# EAGLE design Placa Opto (EAGLE 9.0.1)
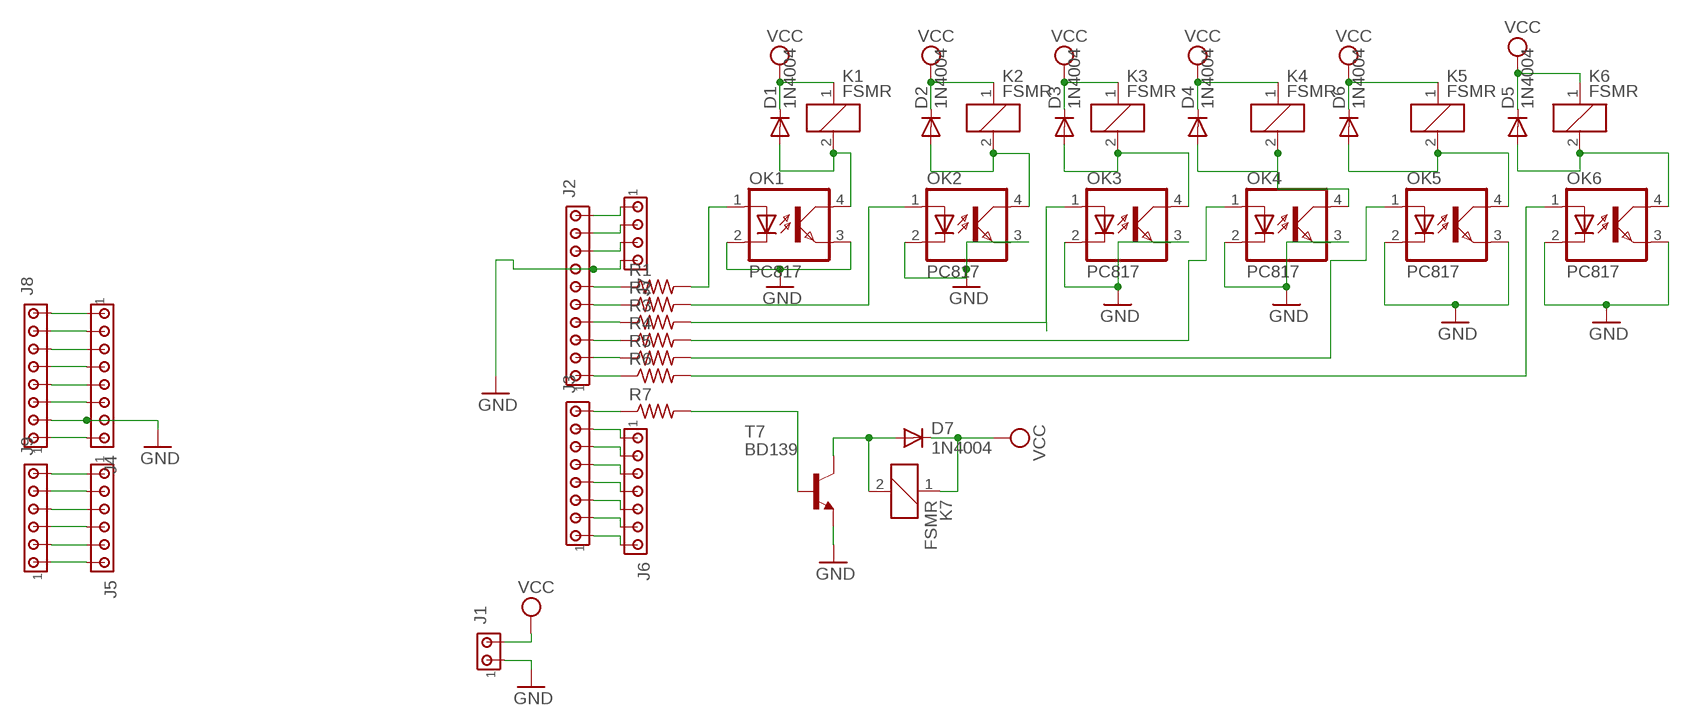
[diagram p0: schematic, sheet 1]

## Parts
D1  1N4004  [DO41-10]
D2  1N4004  [DO41-10]
D3  1N4004  [DO41-10]
D4  1N4004  [DO41-10]
D5  1N4004  [DO41-10]
D6  1N4004  [DO41-10]
D7  1N4004  [DO41-10]
J1  MTA02-156  [1X2MTA]
J2  MTA10-100  [10X10MTA]
J3  MTA08-100  [10X08MTA]
J4  MTA08-100  [10X08MTA]
J5  MTA06-100  [10X06MTA]
J6  MTA07-100  [10X07MTA]
J7  MTA04-100  [10X04MTA]
J8  MTA08-100  [10X08MTA]
J9  MTA06-100  [10X06MTA]
K1  FSMR  [FSMR]
K2  FSMR  [FSMR]
K3  FSMR  [FSMR]
K4  FSMR  [FSMR]
K5  FSMR  [FSMR]
K6  FSMR  [FSMR]
K7  FSMR  [FSMR]
OK1  PC817  [DIL04]
OK2  PC817  [DIL04]
OK3  PC817  [DIL04]
OK4  PC817  [DIL04]
OK5  PC817  [DIL04]
OK6  PC817  [DIL04]
R1  R-US_0207/10  [0207/10]
R2  R-US_0207/10  [0207/10]
R3  R-US_0207/10  [0207/10]
R4  R-US_0207/10  [0207/10]
R5  R-US_0207/10  [0207/10]
R6  R-US_0207/10  [0207/10]
R7  R-US_0207/10  [0207/10]
T7  BD139  [TO126]

## Nets
GND: J1.1 J2.7 J4.7 J7.4 J8.2 OK1.2(C) OK1.3(EMIT) OK2.2(C) OK2.3(EMIT) OK3.2(C) OK3.3(EMIT) OK4.2(C) OK4.3(EMIT) OK5.2(C) OK5.3(EMIT) OK6.2(C) OK6.3(EMIT) T7.1(E)
N$1: J2.1 R6.1
N$2: J2.2 R5.1
N$3: J2.3 R4.1
N$4: J2.4 R3.1
N$5: J2.5 R2.1
N$6: J2.6 R1.1
N$7: OK1.1(A) R1.2
N$8: D1.A K1.2 OK1.4(COL)
N$9: OK2.1(A) R2.2
N$10: D2.A K2.2 OK2.4(COL)
N$11: OK3.1(A) R3.2
N$12: D3.A K3.2 OK3.4(COL)
N$13: OK4.1(A) R4.2
N$14: D4.A K4.2 OK4.4(COL)
N$15: OK5.1(A) R5.2
N$16: OK6.1(A) R6.2
N$18: D5.A K6.2 OK6.4(COL)
N$19: J3.8 R7.1
N$20: R7.2 T7.3(B)
N$21: D7.A K7.2 T7.2(C)
N$22: D6.A K5.2 OK5.4(COL)
N$23: J3.7 J6.1
N$24: J3.6 J6.2
N$25: J3.5 J6.3
N$26: J3.4 J6.4
N$27: J3.3 J6.5
N$28: J3.2 J6.6
N$29: J3.1 J6.7
N$31: J2.8 J7.3
N$32: J2.9 J7.2
N$33: J2.10 J7.1
N$34: J4.1 J8.8
N$35: J4.2 J8.7
N$36: J4.3 J8.6
N$37: J4.4 J8.5
N$38: J4.5 J8.4
N$39: J4.6 J8.3
N$41: J4.8 J8.1
N$42: J5.1 J9.6
N$43: J5.2 J9.5
N$44: J5.3 J9.4
N$45: J5.4 J9.3
N$46: J5.5 J9.2
N$47: J5.6 J9.1
VCC: D1.C D2.C D3.C D4.C D5.C D6.C D7.C J1.2 K1.1 K2.1 K3.1 K4.1 K5.1 K6.1 K7.1
Unconnected: K1.O(2:O) K1.P(2:P) K1.P@(2:P) K1.S(2:S) K2.O(2:O) K2.P(2:P) K2.P@(2:P) K2.S(2:S) K3.O(2:O) K3.P(2:P) K3.P@(2:P) K3.S(2:S) K4.O(2:O) K4.P(2:P) K4.P@(2:P) K4.S(2:S) K5.O(2:O) K5.P(2:P) K5.P@(2:P) K5.S(2:S) K6.O(2:O) K6.P(2:P) K6.P@(2:P) K6.S(2:S) K7.O(2:O) K7.P(2:P) K7.P@(2:P) K7.S(2:S)

## Library data of the parts
D1-D7 = diode:1N4004: DIODE general purpose rectifier, 1 A
J1 = con-amp:MTA02-156: AMP connector
J2 = con-amp:MTA10-100: AMP connector
J3 J4 J8 = con-amp:MTA08-100: AMP connector
J5 J9 = con-amp:MTA06-100: AMP connector Connection corrected 2014-09-19
J6 = con-amp:MTA07-100: AMP connector
J7 = con-amp:MTA04-100: AMP connector
K1-K7 = relay:FSMR: RELAY 1 x switch, same as FBR21D/H, Fujitsu; OC_FARNELL: unknown; OC_NEWARK: unknown
OK1-OK6 = optocoupler:PC817: SHARP OPTO COUPLER; MPN: PC817X4J000F; OC_FARNELL: 9707727; OC_NEWARK: 97K7059
R1-R7 = rcl:R-US_: RESISTOR, American symbol; SPICEPREFIX: R
T7 = transistor-neu-to92:BD139: NPN TRANSISTOR

## Board
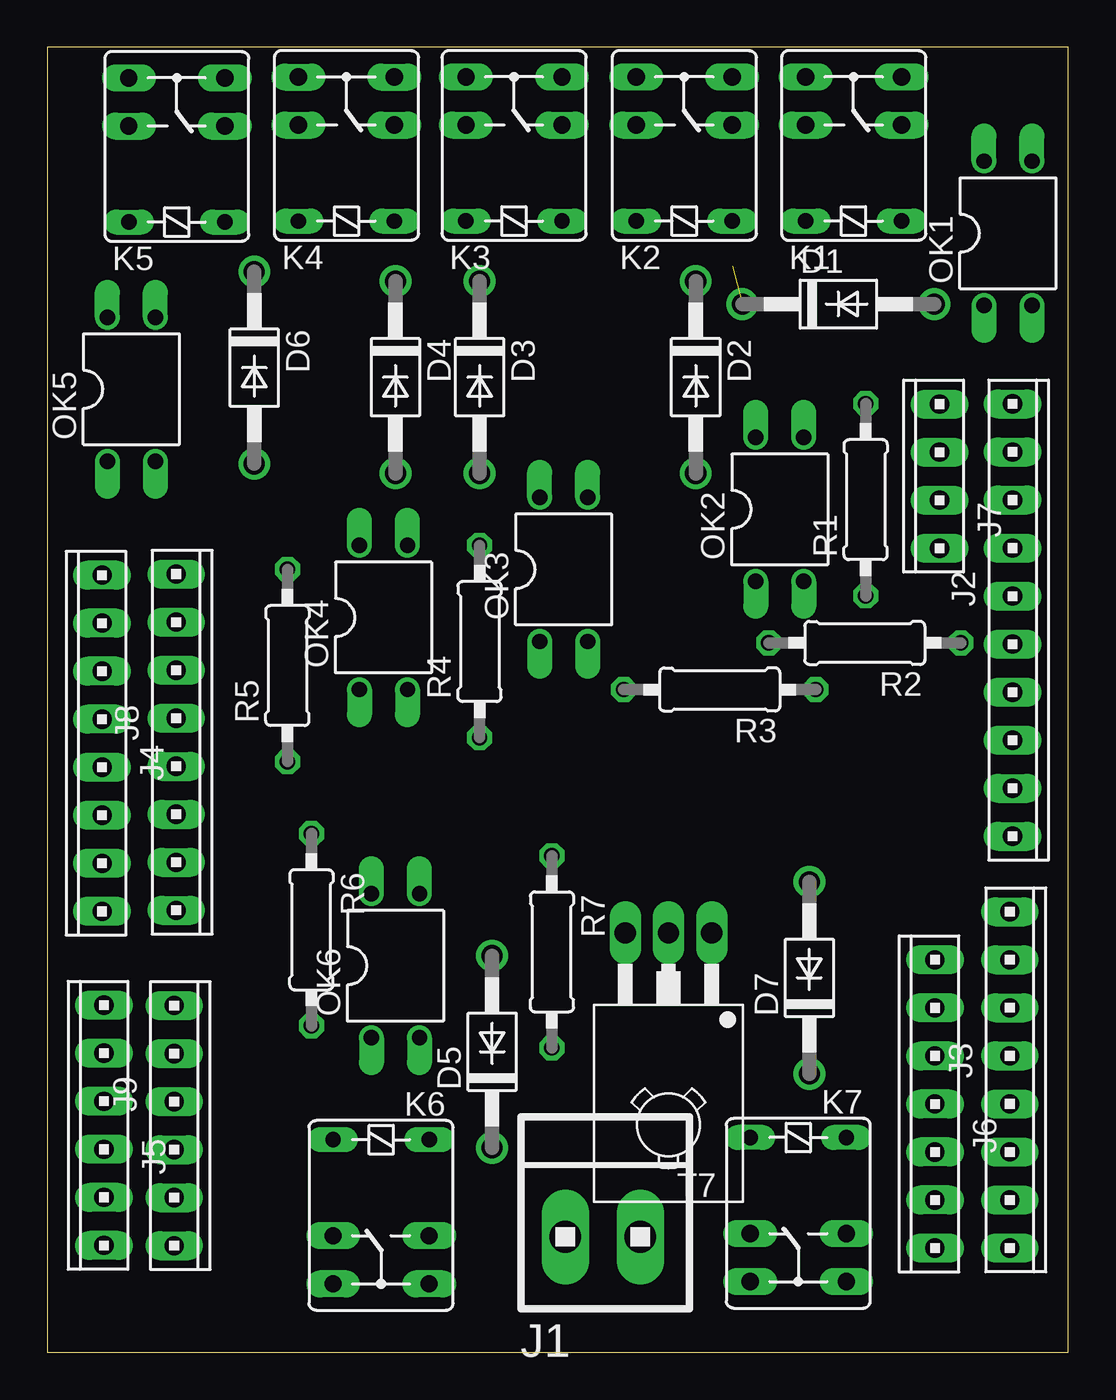
[diagram p1: board, top side]
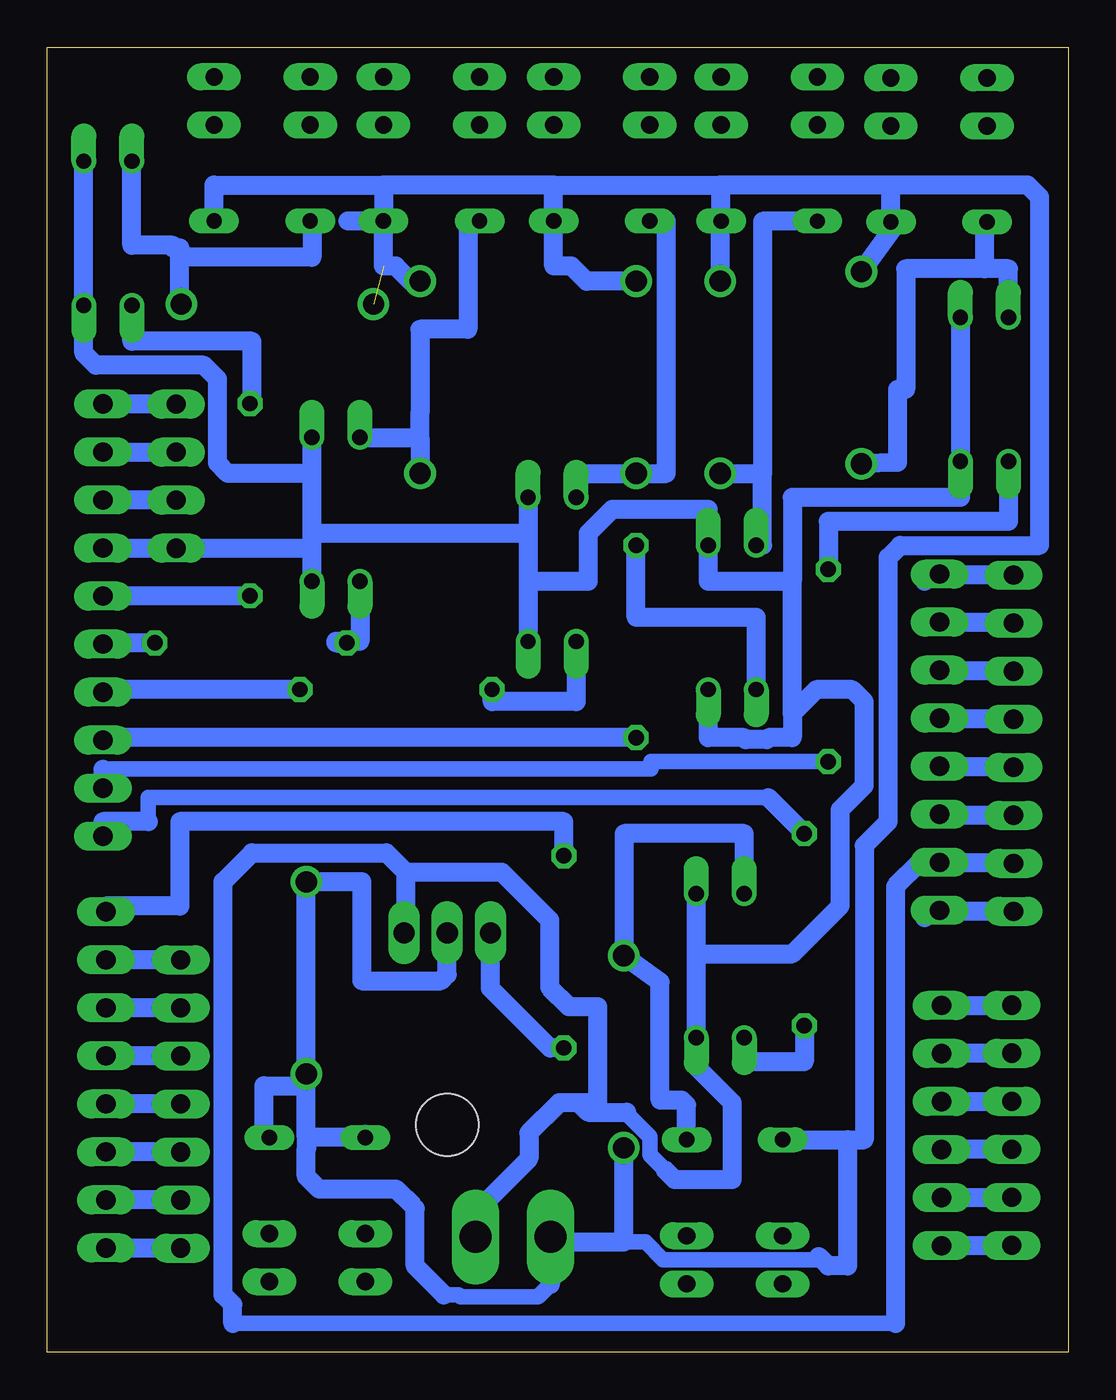
[diagram p2: board, bottom side, seen from below]

Size 54 x 69 mm. Coordinates in mm from the lower left corner, seen from the top.
Outline: 0,0 54,0 54,69 0,69 0,0
Copper layers (1*16): Top 0.035mm / dielectric 1.5mm / Bottom 0.035mm
Design rules "default": minimum track width 6mil, minimum drill 0.35mm, track to track 6mil, track to pad 6mil, pad to pad 6mil, via to via 6mil, smd to smd 6mil, copper to edge 40mil, drill to drill 6mil, minimum pad ring 10mil, minimum via ring 8mil, stop-mask expansion 4mil, vias tented up to drill 0mil, thermal gap 10mil

### Footprints (pad centres in the part's own frame; a part is rotated, then mirrored left to right if it is on the bottom)
DO41-10 = drill 1.118: A 5.08,0; C -5.08,0
1X2MTA = drill 1.676 long: 1 1.981,0; 2 -1.981,0
10X10MTA = drill 1.016 long: 1 11.43,0; 2 8.89,0; 3 6.35,0; 4 3.81,0; 5 1.27,0; 6 -1.27,0; 7 -3.81,0; 8 -6.35,0; 9 -8.89,0; 10 -11.43,0
10X08MTA = drill 1.016 long: 1 8.89,0; 2 6.35,0; 3 3.81,0; 4 1.27,0; 5 -1.27,0; 6 -3.81,0; 7 -6.35,0; 8 -8.89,0
10X06MTA = drill 1.016 long: 1 6.35,0; 2 3.81,0; 3 1.27,0; 4 -1.27,0; 5 -3.81,0; 6 -6.35,0
10X07MTA = drill 1.016 long: 1 7.62,0; 2 5.08,0; 3 2.54,0; 4 0,0; 5 -2.54,0; 6 -5.08,0; 7 -7.62,0
10X04MTA = drill 1.016 long: 1 3.81,0; 2 1.27,0; 3 -1.27,0; 4 -3.81,0
FSMR = drill 0.813 long: 1 5.08,2.54; 2 5.08,-2.54 | drill 0.914 long: O 0,2.54; P -2.54,2.54; P@ -2.54,-2.54; S 0,-2.54
DIL04 = drill 0.813 offset: 1 -1.27,-3.81; 2 1.27,-3.81; 3 1.27,3.81; 4 -1.27,3.81
0207/10 = drill 0.813 octagon: 1 -5.08,0; 2 5.08,0
TO126 = drill 1.118 long: 1 -2.286,-5.08; 2 0,-5.08; 3 2.286,-5.08 | hole 3.302: 0,5.08

### Placement (x,y rotation side)
D1  41.83,55.42 0 top
D2  34.29,51.55 270 top
D3  22.86,51.55 270 top
D4  18.41,51.55 270 top
D5  23.52,15.89 90 top
D6  10.95,52.06 270 top
D7  40.3,19.8 90 top
J1  29.38,6.1 0 top
J2  51.05,38.71 270 top
J3  50.9,14.4 270 top
J4  2.9,32.2 90 top
J5  3,12 90 top
J6  46.94,13.13 90 top
J7  47.19,46.32 90 top
J8  6.81,32.25 270 top
J9  6.71,11.98 270 top
K1  42.64,64.89 270 top
K2  33.68,64.89 270 top
K3  24.68,64.89 270 top
K4  15.82,64.89 270 top
K5  6.85,64.84 270 top
K6  17.65,6.16 90 top
K7  39.72,6.27 90 top
OK1  50.8,59.17 0 top
OK2  38.73,44.56 0 top
OK3  27.3,41.39 0 top
OK4  17.78,38.85 0 top
OK5  4.45,50.92 0 top
OK6  18.41,20.44 0 top
R1  43.28,45.08 90 top
R2  43.23,37.5 180 top
R3  35.56,35.04 180 top
R4  22.86,37.58 90 top
R5  12.7,36.31 90 top
R6  13.97,22.34 270 top
R7  26.68,21.17 270 top
T7  32.85,17.1 180 top

### Tracks (layer width: path | path; a pad name or v marks a point on that pad's centre or on a via)
GND
  Bottom 0.813: 9.14,1.52 44.2,1.52 | 21.34,9.64 22.12,10.43 22.12,11.39 23.37,12.63 23.37,12.69
  Bottom 1.016: J4.7 2.9,25.9 J8.2 7.87,25.9 9.14,24.63 9.14,1.52 | J2.7 J7.4 40.15,42.51 40.01,42.66 | OK5.3 OK5.2 5.71,45.2 14.61,45.2 14.61,40.75 | OK2.2 40.01,42.66 | 40.01,42.66 40.01,43.3 | 40.01,43.3 40.01,46.47 | 40.01,46.47 OK2.3 | OK3.3 28.57,43.3 | 28.57,43.3 28.57,40.75 | 28.57,40.75 OK3.2 | 28.57,43.3 40.01,43.3 | 19.68,21.07 OK6.2 19.68,15.1 17.78,13.2 17.78,9.13 20.83,9.13 21.34,9.64 | 19.68,21.07 OK6.3 19.68,24.88 | OK1.3 OK1.2 52.07,52.82 51.44,52.19 45.72,52.19 45,51.47 45,47.02 44.45,46.47 40.01,46.47 | 19.68,21.07 14.61,21.07 12.06,23.61 12.06,28.69 10.79,29.96 10.79,34.41 11.43,35.04 13.34,35.04 14.61,33.77 | 14.61,33.77 14.61,32.5 15.86,32.5 15.96,32.4 17.06,32.4 17.16,32.5 19.05,32.5 OK4.2 | 14.61,40.75 19.05,40.75 OK4.3 19.05,44.56 24.13,44.56 25.4,43.3 25.4,40.75 28.57,40.75 | 14.61,33.77 14.61,40.75 | 44.2,1.52 44.2,2.53 44.7,3.04 44.7,24.88 43.18,26.4 36.07,26.4 35.05,25.39 | 35.05,25.39 35.05,22.26 T7.1 | 35.05,25.39 29.97,25.39 27.43,22.85 27.43,19.29 26.42,18.28 24.89,18.28 24.89,13.2 25.91,13.2 | 25.91,13.2 26.92,13.2 28.53,11.59 28.53,10.23 31.36,7.41 J1.1 | 25.91,13.2 25.4,12.69 23.37,12.69
N$1
  Bottom 0.813: 15.88,29.33 48.66,29.33 48.66,28.05
  Bottom 1.016: J2.1 51.05,28.05 48.66,28.05 | R6.1 15.88,29.33
N$2
  Bottom 0.813: R5.1 22.07,31.23 22.07,30.84 51.05,30.84
  Bottom 1.016: 51.05,30.59 J2.2 51.05,30.84
N$3
  Bottom 1.016: R4.1 51.44,32.5 51.44,32.36 J2.3
N$4
  Bottom 1.016: R3.1 51.05,35.04 J2.4
N$5
  Bottom 1.016: R2.1 51.05,37.5 J2.5
N$6
  Bottom 1.016: R1.1 51.03,40 J2.6
N$7
  Bottom 1.016: R1.2 43.18,50.16 43.18,53.45 49.53,53.45 OK1.1
N$8
  Bottom 1.016: D1.A 46.99,55.42 46.99,57.9 | 46.99,57.9 46.99,58.39 47.36,58.39 47.36,58.53 49.53,58.53 OK1.4 | K1.2 40.01,59.81 40.01,57.9 46.99,57.9
N$9
  Bottom 1.016: OK2.1 37.47,37.58 38.73,37.58 38.73,37.5 R2.2
N$10
  Bottom 1.016: K2.2 31.75,59.81 31.75,54.09 34.29,54.09 34.29,49.64 34.29,48.38 | 34.29,48.38 D2.A | OK2.4 34.29,48.38
N$11
  Bottom 1.016: 26.04,35.67 OK3.1 26.04,34.41 30.48,34.41 R3.2
N$12
  Bottom 1.016: K3.2 21.26,59.81 21.26,46.47 D3.A 26.04,46.47 OK3.4
N$13
  Bottom 1.016: OK4.1 16.51,38.85 22.86,38.85 R4.2
N$14
  Bottom 1.016: D4.A 16.17,46.47 | K4.2 16.17,59.81 16.17,46.47 | OK4.4 16.17,42.66 16.17,46.47
N$15
  Bottom 1.016: R5.2 12.7,43.93 3.17,43.93 OK5.1
N$16
  Bottom 1.016: R6.2 13.97,15.35 17.14,15.35 OK6.1
N$18
  Bottom 1.016: OK6.4 17.14,27.42 23.5,27.42 23.5,20.97 | 23.5,20.97 D5.A | 20.32,11.55 20.32,11.36 K6.2 20.19,13.07 20.45,13.32 21.59,13.32 21.59,19.57 23.5,20.97
N$19
  Bottom 1.016: J3.8 50.9,23.59 46.99,23.59 46.99,28.05 26.68,28.05 R7.1
N$20
  Bottom 1.016: 30.56,22.98 T7.3 30.56,19.25 27.41,16.09 R7.2
N$21
  Bottom 1.016: K7.2 42.55,11.35 42.55,14.09 40.3,14.09 D7.A 37.37,24.88 37.37,19.64 33.18,19.64 32.85,19.97 T7.2
N$22
  Bottom 1.016: D6.A 9.04,47.05 9.04,50.92 8.6,50.92 8.6,57.29 4.45,57.29 | K5.2 4.45,59.76 4.45,57.29 | OK5.4 3.17,57.29 4.45,57.29
N$23
  Bottom 1.016: J6.1 J3.7
N$24
  Bottom 1.016: J6.2 J3.6
N$25
  Bottom 1.016: J6.3 J3.5
N$26
  Bottom 1.016: J6.4 J3.4
N$27
  Bottom 1.016: J6.5 J3.3
N$28
  Bottom 1.016: J6.6 J3.2
N$29
  Bottom 1.016: J6.7 J3.1
N$31
  Bottom 1.016: J7.3 J2.8
N$32
  Bottom 1.016: J2.9 J7.2
N$33
  Bottom 1.016: J7.1 J2.10
N$34
  Bottom 1.016: J4.1 7.62,41.09 | 7.62,41.09 7.62,40.75 | 7.62,41.09 7.62,41.14 J8.8
N$35
  Bottom 1.016: J8.7 2.9,38.6 J4.2
N$36
  Bottom 1.016: J4.3 6.81,36.01 J8.6
N$37
  Bottom 1.016: J4.4 6.81,33.47 J8.5
N$38
  Bottom 1.016: J8.4 2.9,30.98 J4.5
N$39
  Bottom 1.016: J4.6 6.81,28.39 J8.3
N$41
  Bottom 1.016: J4.8 7.62,23.31 | 7.62,23.31 7.62,22.98 | 7.62,23.31 7.62,23.36 J8.1
N$42
  Bottom 1.016: J9.6 6.71,18.35 J5.1
N$43
  Bottom 1.016: J5.2 6.71,15.81 J9.5
N$44
  Bottom 1.016: J9.4 6.71,13.27 J5.3
N$45
  Bottom 1.016: J5.4 6.71,10.73 J9.3
N$46
  Bottom 1.016: J9.2 6.71,8.19 J5.5
N$47
  Bottom 1.016: J5.6 3,5.63 J9.1
VCC  (1 unrouted)
  Bottom 0.813: 12.7,4.56 13.03,4.89 21.43,4.89 22.37,5.83 23.52,5.83 | 27.39,3.58 28.05,2.92 32.15,2.92 32.26,3.04 33.02,3.04
  Bottom 1.016: K2.1 38.1,59.81 | D2.C 34.78,56.63 35.58,57.43 36.22,57.43 K2.1 | 36.22,61.71 K2.1 | D3.C 25.48,56.63 26.28,57.43 27.22,57.43 K3.1 27.22,61.71 | 27.22,61.71 36.22,61.71 | K1.1 45.18,61.71 36.22,61.71 | D4.C 18.41,59.81 | K4.1 18.41,59.81 | 18.41,61.71 18.41,59.81 | 27.22,61.71 18.41,61.71 | D6.C 9.04,59.76 K5.1 9.39,61.71 | 9.39,61.71 18.41,61.71 | D5.C 23.52,5.83 27.12,5.83 J1.2 | 27.94,6.1 J1.2 | 37.17,11.55 K7.1 40.27,11.35 | 40.27,11.35 40.3,11.35 D7.C | 15.24,11.24 K6.1 11.68,11.24 | 11.68,11.24 10.79,11.24 10.79,26.78 9.53,28.05 9.53,42.03 8.89,42.66 1.52,42.66 1.52,61.08 2.16,61.71 9.39,61.71 | 11.68,11.24 11.68,4.56 12.7,4.56 13.21,5.07 | J1.2 27.39,3.58 | 33.02,3.04 34.54,4.56 34.54,7.61 34.64,7.7 35.56,8.62 39.62,8.62 40.3,9.3 40.3,10.78 40.27,10.8 40.27,11.35